# Altium project JDDZ_PCB_Project.PrjPcb
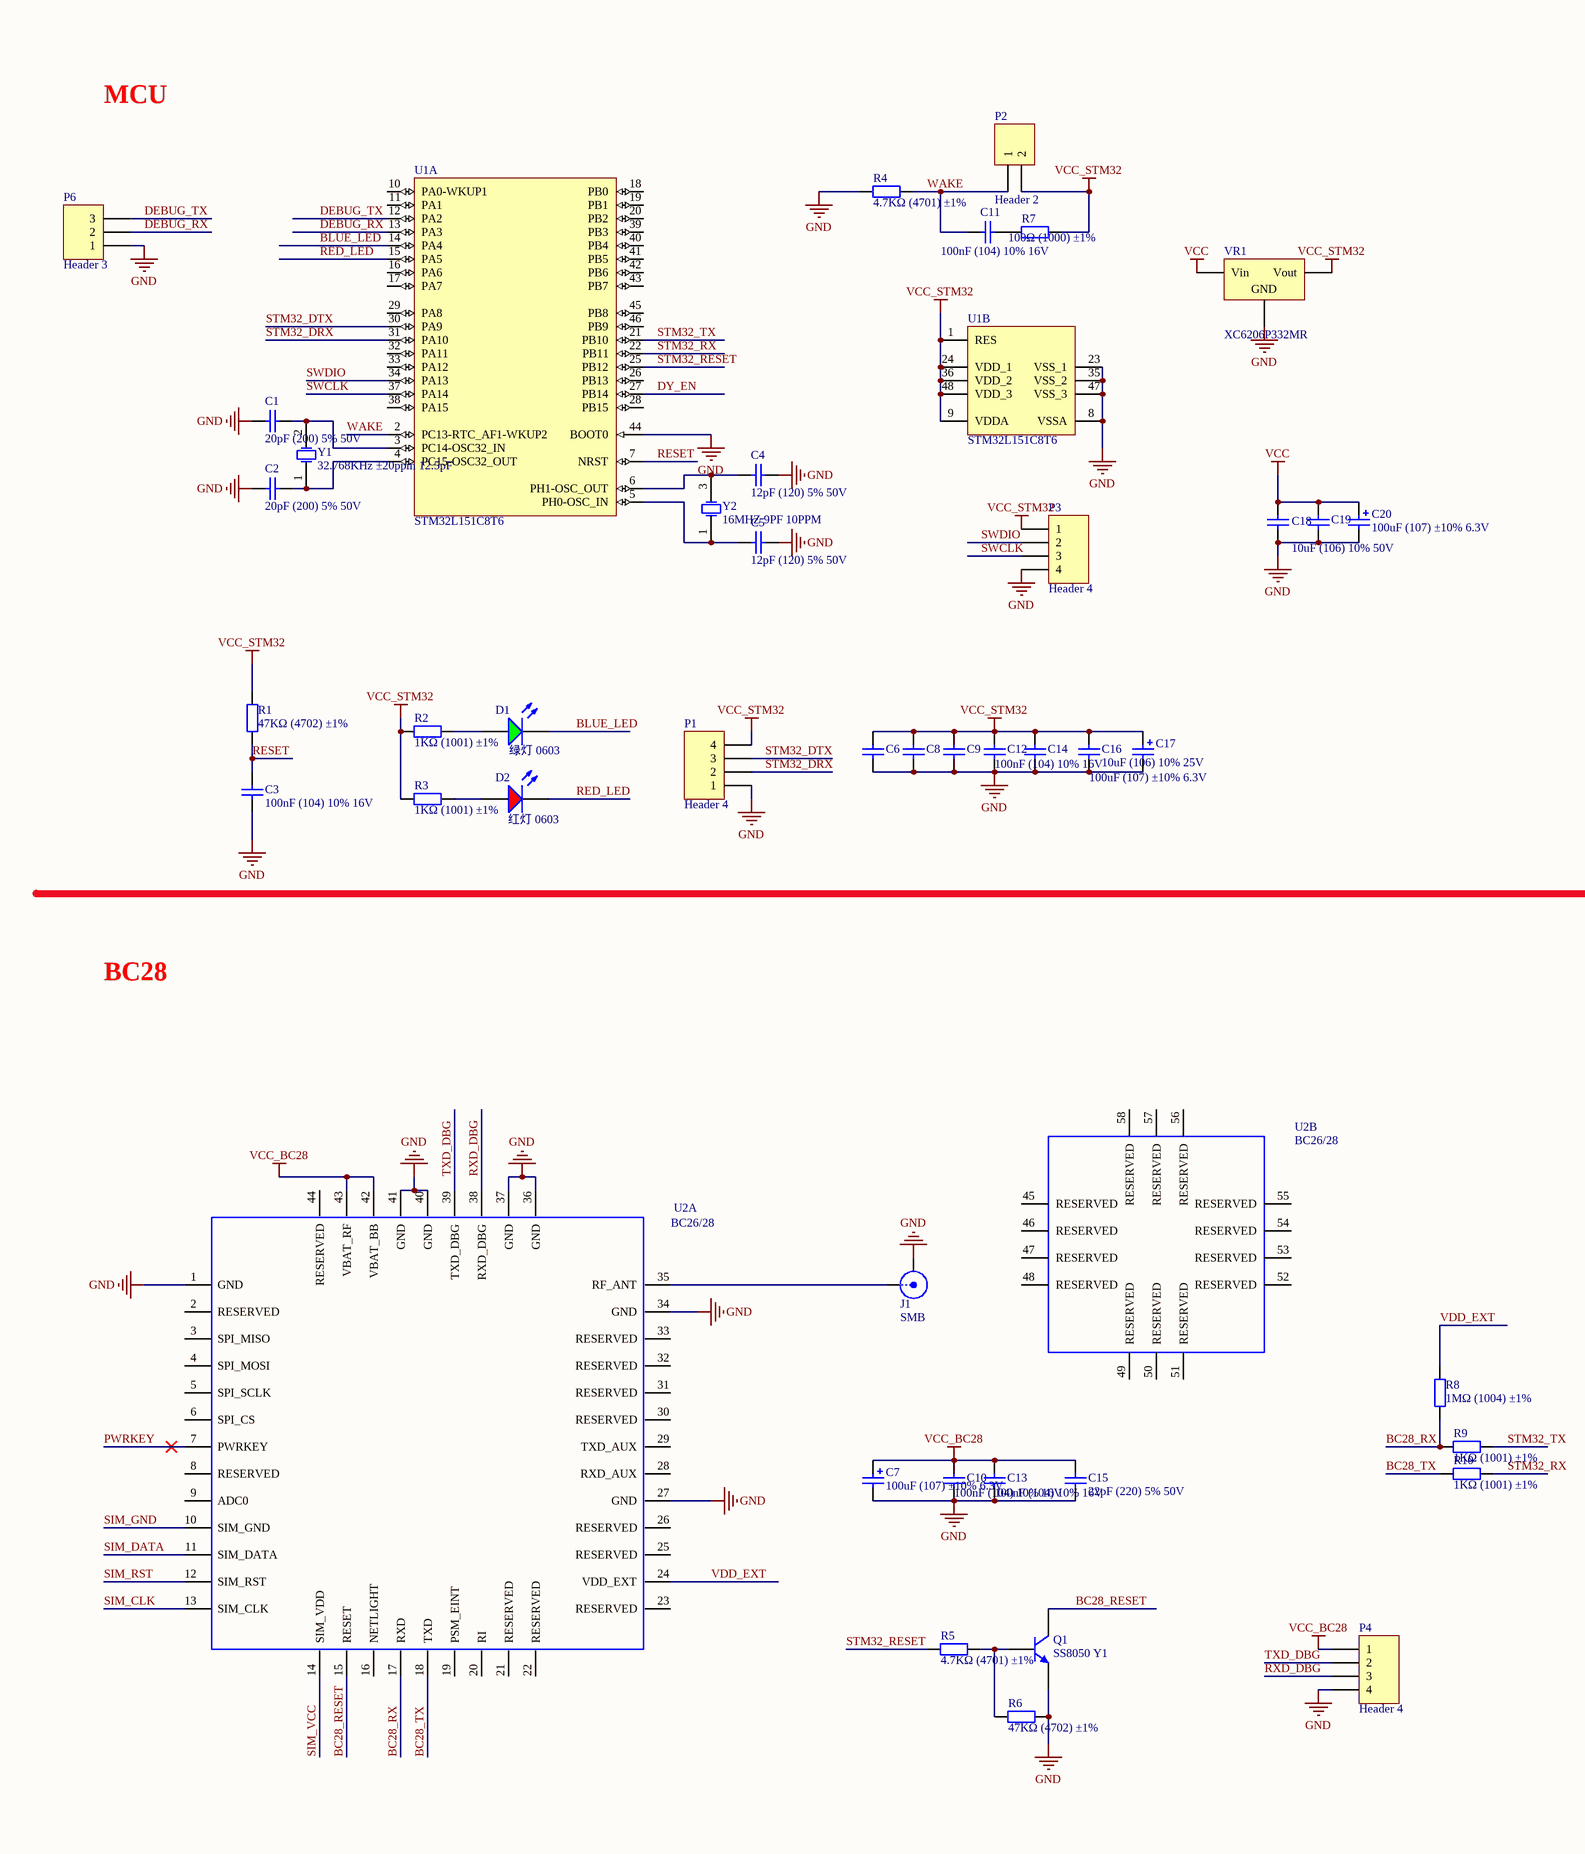
[diagram p0: JDDZ.SchDoc, left]
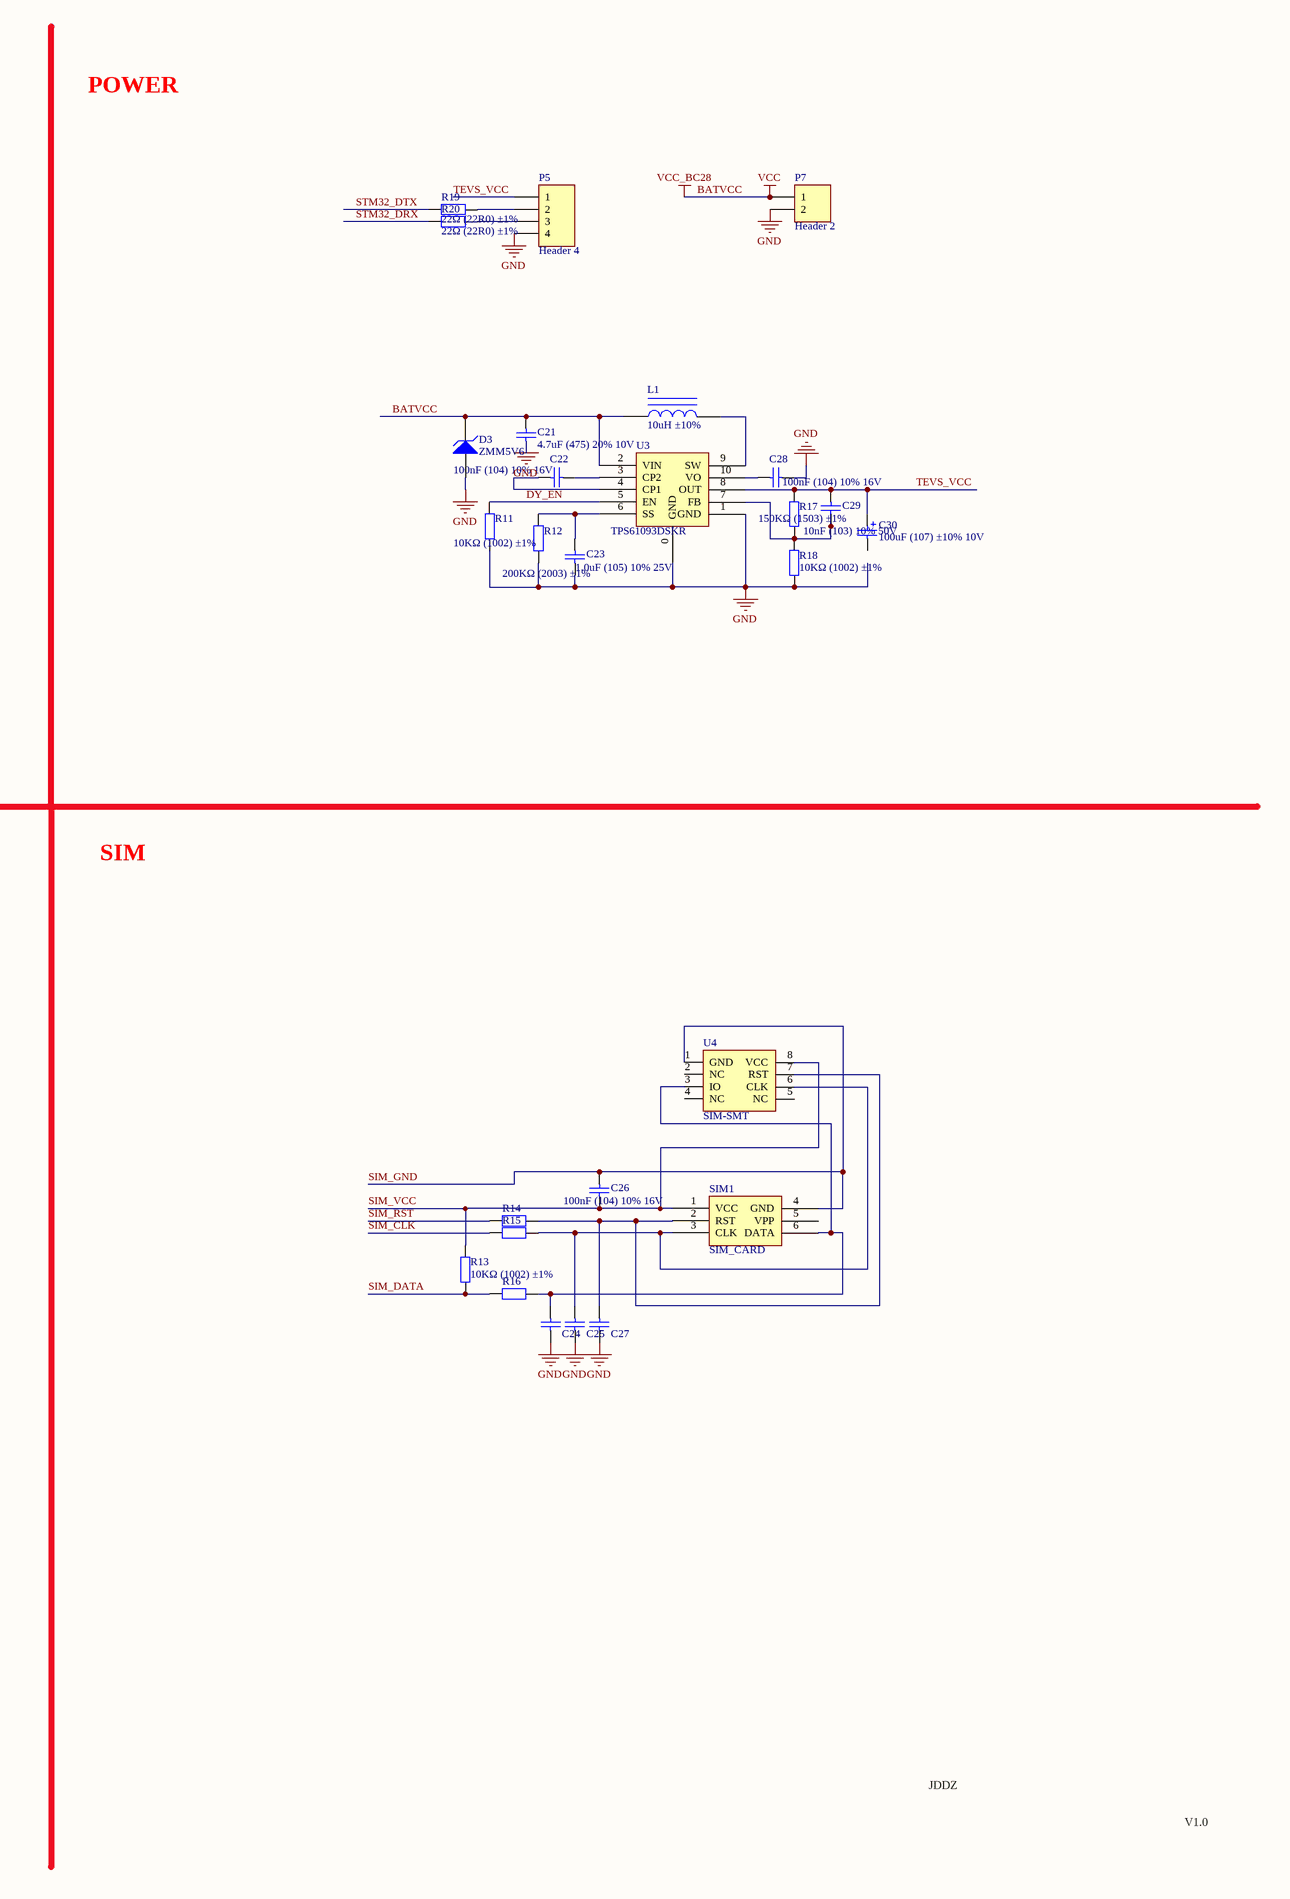
[diagram p1: JDDZ.SchDoc, right]
1 sheet, 71 parts. Net scope: global (net labels, ports and power ports of the same name join across sheets).
Board file: JDDZ.PcbDoc

## Sheet JDDZ.SchDoc
size A2

### Parts
C1  20pF (200) 5% 50V  [0402_C]
C2  20pF (200) 5% 50V  [0402_C]
C3  100nF (104) 10% 16V  [0402_C]
C4  12pF (120) 5% 50V  [0402_C]
C5  12pF (120) 5% 50V  [0402_C]
C6  100nF (104) 10% 16V  [0402_C]  (value not drawn)
C7  100uF (107) ±10% 6.3V  [CASE-B_3528]
C8  100nF (104) 10% 16V  [0402_C]  (value not drawn)
C9  100nF (104) 10% 16V  [0402_C]  (value not drawn)
C10  100nF (104) 10% 16V  [0402_C]
C11  100nF (104) 10% 16V  [0402_C]
C12  100nF (104) 10% 16V  [0402_C]  (value not drawn)
C13  100nF (104) 10% 16V  [0402_C]
C14  100nF (104) 10% 16V  [0402_C]
C15  22pF (220) 5% 50V  [0402_C]
C16  10uF (106) 10% 25V  [0805_C]
C17  100uF (107) ±10% 6.3V  [CASE-B_3528]
C18  10uF (106) 10% 10V  [0603_C]  (value not drawn)
C19  10uF (106) 10% 50V  [1206_C]
C20  100uF (107) ±10% 6.3V  [CASE-B_3528]
C21  4.7uF (475) 20% 10V  [0402_C]
C22  100nF (104) 10% 16V  [0402_C]
C23  1.0uF (105) 10% 25V  [0402_C]
C24  33pF (330) 5% 50V  [0402_C]  (value not drawn)
C25  33pF (330) 5% 50V  [0402_C]  (value not drawn)
C26  100nF (104) 10% 16V  [0402_C]
C27  33pF (330) 5% 50V  [0402_C]  (value not drawn)
C28  100nF (104) 10% 16V  [0402_C]
C29  10nF (103) 10% 50V  [0402_C]
C30  100uF (107) ±10% 10V  [CASE-B_3528]
D1  绿灯 0603  [0603_LED_S1]
D2  红灯 0603  [0603_LED_S1]
D3  ZMM5V6  [LL-34]
J1  SMB  [IPX_SMT]
L1  10uH ±10%  [0603_L]
P1  Header 4  [HDR1X4]
P2  Header 2  [HDR1X2]
P3  Header 4  [HDR1X4]
P4  Header 4  [HDR1X4]
P5  Header 4  [HDR1X4]
P6  Header 3  [HDR1X3]
P7  Header 2  [HDR1X2]
Q1  SS8050 Y1  [SOT-23(SOT-23-3)]
R1  47KΩ (4702) ±1%  [0402_R]
R2  1KΩ (1001) ±1%  [0402_R]
R3  1KΩ (1001) ±1%  [0402_R]
R4  4.7KΩ (4701) ±1%  [0402_R]
R5  4.7KΩ (4701) ±1%  [0402_R]
R6  47KΩ (4702) ±1%  [0402_R]
R7  100Ω (1000) ±1%  [0402_R]
R8  1MΩ (1004) ±1%  [0402_R]
R9  1KΩ (1001) ±1%  [0402_R]
R10  1KΩ (1001) ±1%  [0402_R]
R11  10KΩ (1002) ±1%  [0402_R]
R12  200KΩ (2003) ±1%  [0402_R]
R13  10KΩ (1002) ±1%  [0402_R]
R14  22Ω (22R0) ±1%  [0402_R]  (value not drawn)
R15  22Ω (22R0) ±1%  [0402_R]  (value not drawn)
R16  22Ω (22R0) ±1%  [0402_R]  (value not drawn)
R17  150KΩ (1503) ±1%  [0402_R]
R18  10KΩ (1002) ±1%  [0402_R]
R19  22Ω (22R0) ±1%  [0402_R]
R20  22Ω (22R0) ±1%  [0402_R]
SIM1  SIM_CARD  [microSIMauto]
U1  STM32L151C8T6  [LQFP-48_7x7x05P]  (parts A,B of 2)
U2  BC26/28  [bc26]  (parts A,B of 2)
U3  TPS61093DSKR  [LC-WSON-10_2.5x2.5mm]
U4  SIM-SMT  [SIM-SOP]
VR1  XC6206P332MR  [SOT-23-3L]
Y1  32.768KHz ±20ppm 12.5pF  [SMD-3215_2P FC - 135]
Y2  16MHZ 9PF 10PPM  [SMD-3225_4P]

### Nets
BATVCC: C7.1 C10.2 C13.2 C15.2 C18.2 C19.2 C20.1 C21.2 D3.2(K) L1.1 P4.1 P7.1 U2.42(VBAT_BB) U2.43(VBAT_RF) U3.2(VIN) VR1.3(Vin)  [also labelled VCC, VCC_BC28]
GND: C1.1 C2.1 C3.1 C4.2 C5.2 C6.1 C7.2 C8.1 C9.1 C10.1 C12.1 C13.1 C14.1 C15.1 C16.1 C17.2 C18.1 C19.1 C20.2 C21.1 C23.1 C24.1 C25.1 C27.1 C28.2 D3.1(A) J1.2(Y) P1.1 P3.4 P4.4 P5.4 P6.1 P7.2 Q1.2(E) R4.1 R6.2 R11.1 R12.1 R18.1 U1.8(VSSA) U1.23(VSS_1) U1.35(VSS_2) U1.44(BOOT0) U1.47(VSS_3) U2.1(GND) U2.27(GND) U2.34(GND) U2.36(GND) U2.37(GND) U2.40(GND) U2.41(GND) U3.0(GND) U3.1(GND) VR1.1(GND)
VCC_STM32: C6.2 C8.2 C9.2 C12.2 C14.2 C16.2 C17.1 P1.4 P2.2 P3.1 R1.2 R2.1 R3.1 R7.2 U1.1(RES) U1.9(VDDA) U1.24(VDD_1) U1.36(VDD_2) U1.48(VDD_3) VR1.2(Vout)
BC28_RESET: Q1.3(C) U2.15(RESET)
BC28_RX: R8.1 R9.1 U2.17(RXD)
BC28_TX: R10.1 U2.18(TXD)
BLUE_LED: D1.K U1.14(PA4)
DEBUG_RX: P6.2 U1.13(PA3)
DEBUG_TX: P6.3 U1.12(PA2)
DY_EN: R11.2 U1.27(PB14) U3.5(EN)
PWRKEY: U2.7(PWRKEY)
RED_LED: D2.K U1.15(PA5)
RESET: C3.2 R1.1 U1.7(NRST)
RXD_DBG: P4.3 U2.38(RXD_DBG)
SIM_CLK: R15.1 U2.13(SIM_CLK)
SIM_DATA: R13.1 R16.1 U2.11(SIM_DATA)
SIM_GND: C26.2 SIM1.4(GND) U2.10(SIM_GND) U4.1(GND)
SIM_RST: R14.1 U2.12(SIM_RST)
SIM_VCC: C26.1 R13.2 SIM1.1(VCC) U2.14(SIM_VDD) U4.8(VCC)
STM32_DRX: P1.2 R20.1 U1.31(PA10)
STM32_DTX: P1.3 R19.1 U1.30(PA9)
STM32_RESET: R5.1 U1.25(PB12)
STM32_RX: R10.2 U1.22(PB11)
STM32_TX: R9.2 U1.21(PB10)
SWCLK: P3.3 U1.37(PA14)
SWDIO: P3.2 U1.34(PA13)
TEVS_VCC: C29.2 C30.1 P5.1 R17.2 U3.8(OUT)
TXD_DBG: P4.2 U2.39(TXD_DBG)
VDD_EXT: R8.2 U2.24(VDD_EXT)
WAKE: C11.1 P2.1 R4.2 U1.2(PC13-RTC_AF1-WKUP2)
NetC1_2: C1.2 U1.3(PC14-OSC32_IN) Y1.2(OSC2)
NetC2_2: C2.2 U1.4(PC15-OSC32_OUT) Y1.1(OSC1)
NetC4_1: C4.1 U1.6(PH1-OSC_OUT) Y2.3(OSC2)
NetC5_1: C5.1 U1.5(PH0-OSC_IN) Y2.1(OSC1)
NetC11_2: C11.2 R7.1
NetC22_1: C22.1 U3.4(CP1)
NetC22_2: C22.2 U3.3(CP2)
NetC23_2: C23.2 R12.2 U3.6(SS)
NetC24_2: C24.2 R16.2 SIM1.6(DATA) U4.3(IO)
NetC25_2: C25.2 R15.2 SIM1.3(CLK) U4.6(CLK)
NetC27_2: C27.2 R14.2 SIM1.2(RST) U4.7(RST)
NetC28_1: C28.1 U3.10(VO)
NetC29_1: C29.1 R17.1 R18.2 U3.7(FB)
NetD1_A: D1.A R2.2
NetD2_A: D2.A R3.2
NetJ1_1: J1.1(X) U2.35(RF_ANT)
NetL1_2: L1.2 U3.9(SW)
NetP5_2: P5.2 R19.2
NetP5_3: P5.3 R20.2
NetQ1_1: Q1.1(B) R5.2 R6.1

Not connected (* = marked no-connect by the designer): C30 2; SIM1 5(VPP); U1 10(PA0-WKUP1) 11(PA1) 16(PA6) 17(PA7) 18(PB0) 19(PB1) 20(PB2) 26(PB13) 28(PB15) 29(PA8) 32(PA11) 33(PA12) 38(PA15) 39(PB3) 40(PB4) 41(PB5) 42(PB6) 43(PB7) 45(PB8) 46(PB9); U2 2(RESERVED) 3(SPI_MISO) 4(SPI_MOSI) 5(SPI_SCLK) 6(SPI_CS) 8(RESERVED) 9(ADC0) 16(NETLIGHT) 19(PSM_EINT) 20(RI) 21(RESERVED) 22(RESERVED) 23(RESERVED) 25(RESERVED) 26(RESERVED) 28(RXD_AUX) 29(TXD_AUX) 30(RESERVED) 31(RESERVED) 32(RESERVED) 33(RESERVED) 44(RESERVED) 45(RESERVED) 46(RESERVED) 47(RESERVED) 48(RESERVED) 49(RESERVED) 50(RESERVED) 51(RESERVED) 52(RESERVED) 53(RESERVED) 54(RESERVED) 55(RESERVED) 56(RESERVED) 57(RESERVED) 58(RESERVED); U4 2(NC) 4(NC) 5(NC)

### Notes on the sheet
- MCU
- POWER
- BC28
- SIM
- JDDZ
- V1.0

### Library data of the parts
C1 C2 = 0402 20pF (200) 5% 50V: 贴片电容; ComponentLink1Description: 供应商链接; ComponentLink1URL: http://www.szlcsc.com/product/details_1906.html; Package: 0402; Supplier: LC; SuppliersPartNumber: C1554
C3 C6 C8-C14 C22 C26 C28 = 0402 100nF (104) 10% 16V: 贴片电容; ComponentLink1Description: 供应商链接; ComponentLink1URL: http://www.szlcsc.com/product/details_1877.html; Package: 0402; Supplier: LC; SuppliersPartNumber: C1525
C4 C5 = 0402 12pF (120) 5% 50V: 贴片电容; ComponentLink1Description: 供应商链接; ComponentLink1URL: http://www.szlcsc.com/product/details_1899.html; Package: 0402; Supplier: LC; SuppliersPartNumber: C1547
C7 C17 C20 C30 = 3528 100uF (107) 10% 6.3V: 钽电容; ComponentLink1Description: 供应商链接; ComponentLink1URL: http://www.szlcsc.com/product/details_16815.html; Package: 3528; Supplier: LC; SuppliersPartNumber: C16133
C15 = 0402 22pF (220) 5% 50V: 贴片电容; ComponentLink1Description: 供应商链接; ComponentLink1URL: http://www.szlcsc.com/product/details_1907.html; Package: 0402; Supplier: LC; SuppliersPartNumber: C1555
C16 = 0805 10uF (106) 10% 25V: 贴片电容; ComponentLink1Description: 供应商链接; ComponentLink1URL: http://www.szlcsc.com/product/details_16532.html; Package: 0805; Supplier: LC; SuppliersPartNumber: C15850
C18 = 0603 10uF (106) 10% 10V: 贴片电容; ComponentLink1Description: 供应商链接; ComponentLink1URL: http://www.szlcsc.com/product/details_20411.html; Package: 0603; Supplier: LC; SuppliersPartNumber: C19702
C19 = 1206 10uF (106) 10% 50V: 贴片电容; ComponentLink1Description: 供应商链接; ComponentLink1URL: http://www.szlcsc.com/product/details_14236.html; Package: 1206; Supplier: LC; SuppliersPartNumber: C13585
C21 = 0402 4.7uF (475) 20% 10V: 贴片电容; ComponentLink1Description: 供应商链接; ComponentLink1URL: http://www.szlcsc.com/product/details_24469.html; Package: 0402; Supplier: LC; SuppliersPartNumber: C23733
C23 = 0402 1.0uF (105) 10% 25V: 贴片电容; ComponentLink1Description: 供应商链接; ComponentLink1URL: http://www.szlcsc.com/product/details_53938.html; Package: 0402; Supplier: LC; SuppliersPartNumber: C52923
C24 C25 C27 = 0402 33pF (330) 5% 50V: 贴片电容; ComponentLink1Description: 供应商链接; ComponentLink1URL: http://www.szlcsc.com/product/details_1914.html; Package: 0402; Supplier: LC; SuppliersPartNumber: C1562
C29 = 0402 10nF (103) 10% 50V: 贴片电容; ComponentLink1Description: 供应商链接; ComponentLink1URL: http://www.szlcsc.com/product/details_15869.html; Package: 0402; Supplier: LC; SuppliersPartNumber: C15195
D1 = 0603 绿灯: 发光二极管; ComponentLink1Description: 供应商链接; ComponentLink1URL: http://www.szlcsc.com/product/details_73152.html; Package: 0603; Supplier: LC; SuppliersPartNumber: C72043
D2 = 0603 红灯: 发光二极管; ComponentLink1Description: 供应商链接; ComponentLink1URL: http://www.szlcsc.com/product/details_2659.html; Package: 0603; Supplier: LC; SuppliersPartNumber: C2286
D3 = LL-34 ZMM5V6: 稳压二极管; ComponentLink1Description: 供应商链接; ComponentLink1URL: http://www.szlcsc.com/product/details_8541.html; Package: LL-34; Supplier: LC; SuppliersPartNumber: C8062
J1 = SMB: SMB Straight Connector; LatestRevisionDate: 17-Jul-2002; LatestRevisionNote: Re-released for DXP Platform.; Publisher: Altium Limited
L1 = 0603 10uH 10%: 贴片电感; ComponentLink1Description: 供应商链接; ComponentLink1URL: http://www.szlcsc.com/product/details_1387.html; Package: 0603; Supplier: LC; SuppliersPartNumber: C1035
P1 P3-P5 = Header 4: Header, 4-Pin; LatestRevisionDate: 17-Jul-2002; LatestRevisionNote: Re-released for DXP Platform.; Publisher: Altium Limited
P2 P7 = Header 2: Header, 2-Pin; LatestRevisionDate: 17-Jul-2002; LatestRevisionNote: Re-released for DXP Platform.; Publisher: Altium Limited
P6 = Header 3: Header, 3-Pin; LatestRevisionDate: 17-Jul-2002; LatestRevisionNote: Re-released for DXP Platform.; Publisher: Altium Limited
Q1 = SOT-23 SS8050 Y1: 三极管; ComponentLink1Description: 供应商链接; ComponentLink1URL: http://www.szlcsc.com/product/details_2507.html; Package: SOT-23; Supplier: LC; SuppliersPartNumber: C2150
R1 R6 = 0402 47KΩ (4702) 1%: 贴片电阻; ComponentLink1Description: 供应商链接; ComponentLink1URL: http://www.szlcsc.com/product/details_26535.html; Package: 0402; Supplier: LC; SuppliersPartNumber: C25792
R2 R3 R9 R10 = 0402 1KΩ (1001) 1%: 贴片电阻; ComponentLink1Description: 供应商链接; ComponentLink1URL: http://www.szlcsc.com/product/details_12256.html; Package: 0402; Supplier: LC; SuppliersPartNumber: C11702
R4 R5 = 0402 4.7KΩ (4701) 1%: 贴片电阻; ComponentLink1Description: 供应商链接; ComponentLink1URL: http://www.szlcsc.com/product/details_26643.html; Package: 0402; Supplier: LC; SuppliersPartNumber: C25900
R7 = 0402 100Ω (1000) 1%: 贴片电阻; ComponentLink1Description: 供应商链接; ComponentLink1URL: http://www.szlcsc.com/product/details_25819.html; Package: 0402; Supplier: LC; SuppliersPartNumber: C25076
R8 = 0402 1MΩ (1004) 1%: 贴片电阻; ComponentLink1Description: 供应商链接; ComponentLink1URL: http://www.szlcsc.com/product/details_26826.html; Package: 0402; Supplier: LC; SuppliersPartNumber: C26083
R11 R13 R18 = 0402 10KΩ (1002) 1%: 贴片电阻; ComponentLink1Description: 供应商链接; ComponentLink1URL: http://www.szlcsc.com/product/details_26487.html; Package: 0402; Supplier: LC; SuppliersPartNumber: C25744
R12 = 0402 200KΩ (2003) 1%: 贴片电阻; ComponentLink1Description: 供应商链接; ComponentLink1URL: http://www.szlcsc.com/product/details_26507.html; Package: 0402; Supplier: LC; SuppliersPartNumber: C25764
R14-R16 R19 R20 = 0402 22Ω (22R0) 1%: 贴片电阻; ComponentLink1Description: 供应商链接; ComponentLink1URL: http://www.szlcsc.com/product/details_25835.html; Package: 0402; Supplier: LC; SuppliersPartNumber: C25092
R17 = 0402 150KΩ (1503) 1%: 贴片电阻; ComponentLink1Description: 供应商链接; ComponentLink1URL: http://www.szlcsc.com/product/details_26498.html; Package: 0402; Supplier: LC; SuppliersPartNumber: C25755
U1 = STM32L151C8T6: ARM; ComponentLink1Description: 供应商链接; ComponentLink1URL: http://www.szlcsc.com/product/details_10393.html; Package: LQFP-48_7x7x05P; Supplier: LC; SuppliersPartNumber: C9861
U2 = BC26: Part Description: *; Value: *; Geometry.Height: *; Manufacturer: *; PCB DECAL: *
VR1 = SOT-23 XC6206P332MR: 低压差线性稳压(LDO); ComponentLink1Description: 供应商链接; ComponentLink1URL: http://www.szlcsc.com/product/details_5896.html; Package: SOT-23; Supplier: LC; SuppliersPartNumber: C5446
Y1 = SMD-3215_2P 32.768KHz 20ppm 12.5pF: 贴片晶振; ComponentLink1Description: 供应商链接; ComponentLink1URL: http://www.szlcsc.com/product/details_33310.html; Package: SMD-3215_2P; Supplier: LC; SuppliersPartNumber: C32346
Y2 = SMD-3225_4P  16MHZ 9PF 10PPM: 贴片晶振; ComponentLink1Description: 供应商链接; ComponentLink1URL: http://www.szlcsc.com/product/details_14393.html; Package: SMD-3225_4P; Supplier: LC; SuppliersPartNumber: C13738